# Altium project WiFi_UPS.PrjPcb
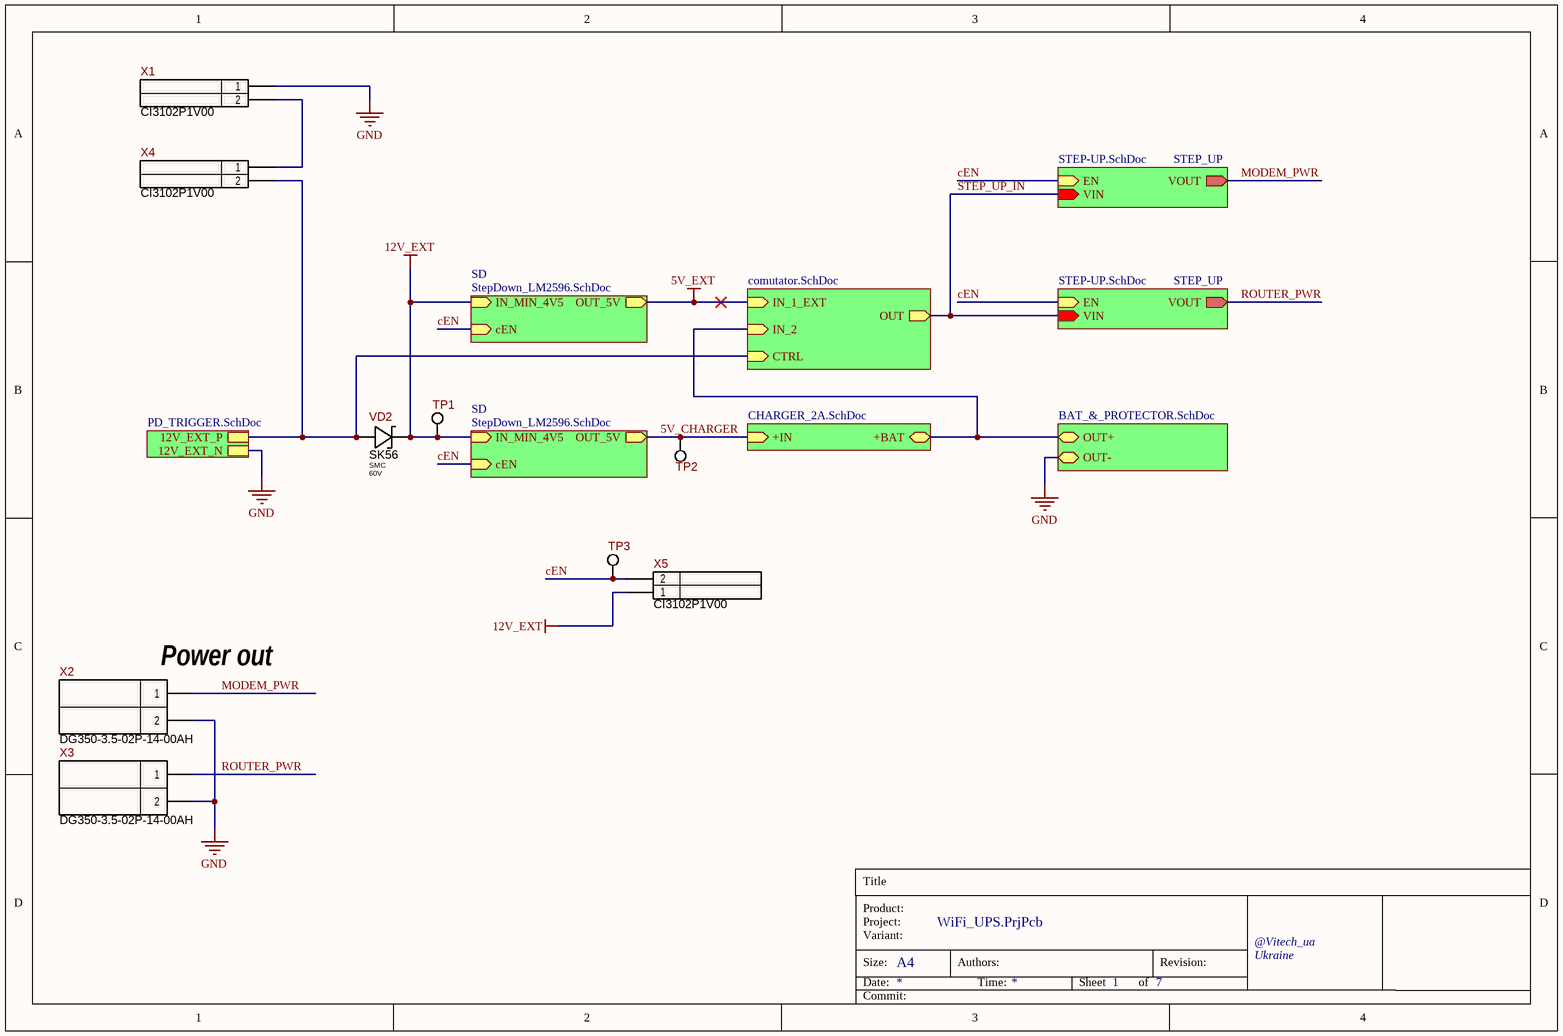
[diagram p0: MAIN.SchDoc]
__Project_Template_Version: 1.0.3; _Amount_Boards_Per_Stand: 1; _PCB_Order_Accuracy: 0.2mm / 8mil; _PCB_Order_BoardOutlineLayer: Mechanical1 (GM1); _PCB_Order_CastellatedHolesEdges: No; _PCB_Order_Cooper: 1oz / 35um; _PCB_Order_ElectricTest: Necessarily for 100% samples; _PCB_Order_Finish: HASL; _PCB_Order_LayersCnt: 2; _PCB_Order_Mask: on both sides; _PCB_Order_MaskColor: Green / Yellow; _PCB_Order_Material: FR-4; _PCB_Order_MinHole: 0.3 mm; _PCB_Order_ProductionTime: 2 weeks; _PCB_Order_Silk: No; _PCB_Order_SilkColor: No; _PCB_Order_Size: 134 x 85 mm; _PCB_Order_Thickness: 1.6 mm; Authors: Starovit; Product_Name: WiFi_UPS; Project_ID: 001; Project_Version: 4
7 sheets, 121 parts. Net scope: hierarchical (ports join the sheet entries above them; power ports are global).
Board file: pcb.PcbDoc
Sheets:
  MAIN.SchDoc
    STEP_UP = STEP-UP.SchDoc
    charger = CHARGER_2A.SchDoc
    COMUTATOR = comutator.SchDoc
    pROTECTOR = BAT_&_PROTECTOR.SchDoc
    Designator = PD_TRIGGER.SchDoc
    SD = StepDown_LM2596.SchDoc
    STEP_UP = STEP-UP.SchDoc
    SD = StepDown_LM2596.SchDoc

## Sheet MAIN.SchDoc: =DocumentName
size A4; Author: Starovit; CompanyName: "AS Manufacturing" LLC; Organization: "AS Manufacturing" LLC; Address1: 5 Sklyarenka St.; Address2: Kyiv 04073; Address3: Ukraine; Address4: https://ajax.systems/en/; DocumentNumber: 1; Revision: v4; SheetNumber: 1; SheetTotal: 7; Product name: WiFi_UPS; Internal reference: 001; Head: WiFi_UPS.001.v4; PCB_Designator: WiFi_UPS.001.v4; Template_version: 1.0.1

### Parts
TP1  PAD-0.96mm  [PAD-0.96mm]  (value not drawn)  (no BOM)
TP2  PAD-0.96mm  [PAD-0.96mm]  (value not drawn)  (no BOM)
TP3  PAD-0.96mm  [PAD-0.96mm]  (value not drawn)  (no BOM)
VD2  Voltage: 60V  [SMC]  (hidden comment: SK56)
X1  WH-02S  [WF-2S]  (value not drawn)
X2  DG350-3.5-02P  [DG350-3.5-02P-14-00AH]  (value not drawn)  (no BOM)
X3  DG350-3.5-02P  [DG350-3.5-02P-14-00AH]  (value not drawn)  (no BOM)
X4  WH-02S  [WF-2S]  (value not drawn)
X5  WH-02S  [WF-2S]  (value not drawn)

### Sub-sheets
charger = CHARGER_2A.SchDoc: +BAT (bidir), +IN (in)
COMUTATOR = comutator.SchDoc: IN_1_EXT (in), IN_2 (in), OUT (out), CTRL (in)
Designator = PD_TRIGGER.SchDoc: 12V_EXT_P, 12V_EXT_N
pROTECTOR = BAT_&_PROTECTOR.SchDoc: OUT+ (bidir), OUT- (bidir)
SD = StepDown_LM2596.SchDoc: IN_MIN_4V5 (in), OUT_5V (out), cEN (in)
SD = StepDown_LM2596.SchDoc: IN_MIN_4V5 (in), OUT_5V (out), cEN (in)
STEP_UP = STEP-UP.SchDoc: VIN (in), VOUT (out), EN (in)
STEP_UP = STEP-UP.SchDoc: VIN (in), VOUT (out), EN (in)

### Nets
5V_EXT: sheet STEP_UP/VIN, sheet COMUTATOR/IN_1_EXT, sheet COMUTATOR/OUT, sheet SD/OUT_5V, sheet STEP_UP/VIN  [also labelled STEP_UP_IN]
12V_EXT: TP1.1 VD2.CA X5.1 ; sheet SD/IN_MIN_4V5, sheet SD/IN_MIN_4V5
GND: X1.1 X2.2 X3.2 ; sheet pROTECTOR/OUT-, sheet Designator/12V_EXT_N
5V_CHARGER: TP2.1 ; sheet charger/+IN, sheet SD/OUT_5V
cEN: TP3.1 X5.2 ; sheet STEP_UP/EN, sheet SD/cEN, sheet STEP_UP/EN, sheet SD/cEN
MODEM_PWR: X2.1 ; sheet STEP_UP/VOUT
ROUTER_PWR: X3.1 ; sheet STEP_UP/VOUT
NetC14_1: sheet charger/+BAT, sheet COMUTATOR/IN_2, sheet pROTECTOR/OUT+
NetFP11_1: VD2.AN X4.2 ; sheet COMUTATOR/CTRL, sheet Designator/12V_EXT_P
NetX1_2: X1.2 X4.1

### Notes on the sheet
- (near X2) Power out
- Title
- Product:
- Project:
- Size:
- Date:
- Variant:
- A4
- Authors:
- Time:
- Sheet
- of
- Revision:
- @Vitech_ua
- Commit:

### Library data of the parts
TP1-TP3 = PAD-0.96mm: 0.96mm Pad for Plug-In or Receptacle; Ajax_1C_PN: NONE; Ajax_1С_Status: RND Only; Component Status: Released; Part Number: PAD-0.96mm; Component Type: PTH; Manufacturer: NONE; Part Type: Pad; Temperature Range: NONE; ComponentLink1URL: NONE; Replacement: NONE; Price: NONE; ComponentLink1Description: Datasheet
VD2 = SS34: Diode Schottky 60V 5A, SMC; Manufacturer: KLS; Component Status: Released; Standard Lead Time: 14 Weeks; Current: 3A; Vf: 500mV @ 3A; Replacement: NONE; Part Number: SK56; Package: SMC; Part Type: Schottky; Component Type: SMD; Marking: SK56; Temperature Range: -55°C ~ 150°C; Supplier 1: Digi-Key; Supplier Part Number 1: SS34FSCT-ND; Price: 0.03; ComponentLink1Description: Datasheet
X1 X4 X5 = CI3102P1V00: WH Series 2.54mm Wire to Board Straight DIP Type Headers, 2 Pin; Manufacturer: CviLux; Replacement: NONE; Part Number: CI3102P1V00; Part Type: Wire-to-Board / Header; Component Type: PTH; Temperature Range: -25℃ ~ 85℃; Price: 0.02434867; ComponentLink1Description: Datasheet
X2 X3 = DG350-3.5-02P-14-00AH: Screw Terminal, 3.5mm Pitch, 2 pin, Green; Manufacturer: Degson; Ajax_1C_ID: 21524; Ajax_1C_PN: DG350-3.5-02P-14-00AH, клеммник; Ajax_1С_Status: RND Only; Component Status: Released; Replacement: NONE; GUID_1C: 367ff815-d639-11ea-ab63-0050569f2651; Part Number: DG350-3.5-02P-14-00AH; Part Type: Terminal; Component Type: PTH; Temperature Range: -40°C ~ 105°C; ComponentLink1URL: \\altiumdb.ajax.local\files\Datasheet\Connectors\DG350-3.5,3.96.pdf; Price: 0,17091154; ComponentLink1Description: Datasheet

## Sheet STEP-UP.SchDoc: =DocumentName
size A4; Author: Starovit; CompanyName: "AS Manufacturing" LLC; Organization: "AS Manufacturing" LLC; Address1: 5 Sklyarenka St.; Address2: Kyiv 04073; Address3: Ukraine; Address4: https://ajax.systems/en/; DocumentNumber: 2; Revision: v4; SheetNumber: 2; SheetTotal: 7; Product name: WiFi_UPS; Internal reference: 001; Head: WiFi_UPS.001.v4; PCB_Designator: WiFi_UPS.001.v4; Template_version: 1.0.1
Used 2 times, as channels STEP_UP, STEP_UP. Parts and nets are listed once, with the designators drawn on the sheet.
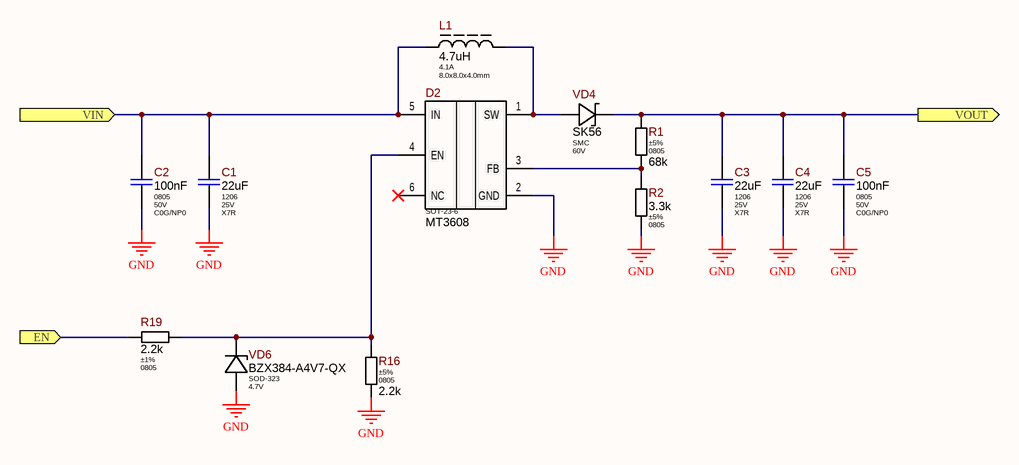
[diagram p1: STEP-UP.SchDoc]

### Parts
C1  Package: 1206  Voltage: 25V  Dielectric Type: X7R  [C_CERAMIC_1206_MED]  (hidden comment: 22uF)
C2  Package: 0805  Voltage: 50V  Dielectric Type: C0G/NP0  [C_CERAMIC_0805_HI]  (hidden comment: 100nF)
C3  Package: 1206  Voltage: 25V  Dielectric Type: X7R  [C_CERAMIC_1206_MED]  (hidden comment: 22uF)
C4  Package: 1206  Voltage: 25V  Dielectric Type: X7R  [C_CERAMIC_1206_MED]  (hidden comment: 22uF)
C5  Package: 0805  Voltage: 50V  Dielectric Type: C0G/NP0  [C_CERAMIC_0805_HI]  (hidden comment: 100nF)
D2  Package: SOT-23-6  [MT3608_MED]  (hidden comment: MT3608)
L1  Current: 4.1A  Package: 8.0x8.0x4.0mm  [SWPA8040S-Series]  (hidden comment: 4.7uH)
R1  Tolerance: ±5%  Package: 0805  [R_ANY_CHIP_0805_MED]  (hidden comment: 68k)
R2  Tolerance: ±5%  Package: 0805  [R_ANY_CHIP_0805_MED]  (hidden comment: 3.3k)
R16  Tolerance: ±5%  Package: 0805  [R_ANY_CHIP_0805_MED]  (hidden comment: 2.2k)
R19  Tolerance: ±1%  Package: 0805  [R_ANY_CHIP_0805_MED]  (hidden comment: 2.2k)
VD4  Voltage: 60V  [SMC]  (hidden comment: SK56)
VD6  Package: SOD-323  Voltage: 4.7V  [SOD-323_MED]  (hidden comment: BZX384-A4V7-QX)

### Ports
EN (in), VIN (in), VOUT (out)

### Nets
GND: C1.2 C2.2 C3.2 C4.2 C5.2 D2.2(GND) R2.2 R16.2 VD6.AN
EN: R19.1 ; port EN
VIN: C1.1 C2.1 D2.5(IN) L1.1 ; port VIN
VOUT: C3.1 C4.1 C5.1 R1.1 VD4.CA ; port VOUT
NetD2_1: D2.1(SW) L1.2 VD4.AN
NetD2_3: D2.3(FB) R1.2 R2.1
NetD2_4: D2.4(EN) R16.1 R19.2 VD6.CA

Not connected (* = marked no-connect by the designer): D2 6(NC)*

### Channels
STEP_UP: designators end in B; ports EN=cEN VIN=5V_EXT VOUT=MODEM_PWR
STEP_UP: designators end in A; ports EN=cEN VIN=5V_EXT VOUT=ROUTER_PWR

### Notes on the sheet
- Title
- Product:
- Project:
- Size:
- Date:
- Variant:
- A4
- Authors:
- Time:
- Sheet
- of
- Revision:
- @Vitech_ua
- Commit:

### Library data of the parts
C1 C3 C4 = 1206B102K102CG: 22uF 25V; Part Number: CL31A226KAHNNNE; Manufacturer: SAMSUNG; Standard Lead Time: 31 Weeks; Component Status: Released; Tolerance: ±10%; Replacement: NONE; Value: 22uF; Part Type: Ceramic / X7R / 1206; Component Type: SMD; Temperature Range: -55°C ~ 125°C; ComponentLink1URL: https://eu.mouser.com/datasheet/2/210/Middle_and_High_Voltage_DS-1535659.pdf; Supplier 1: Mouser; Supplier Part Number 1: 791-1206B102K102CT; Price: 0; ComponentLink1Description: Datasheet
C2 C5 = CERAMIC_0805: Part Number: **; Manufacturer: Hitano; Component Status: Released; Tolerance: ±5%; Replacement: NONE; GUID_1C: 32087c8a-96b8-11ea-ab61-0050569f2651; Part Type: Ceramic / C0G(NP0) / 0402; Component Type: SMD; Temperature Range: -55°C ~ 125°C; ComponentLink1URL: \\altiumdb.ajax.local\files\Datasheet\Capacitor\Hitano-MLCC.pdf; Price: 0; ComponentLink1Description: Datasheet; Value: 100nF
D2 = MT3608: 2V-24V Input High Efficiency 1.2MHz 2A Step Up Converter; Manufacturer: Aerosemi; Ajax_1C_ID: 8101; Ajax_1C_PN: MT3608 Aerosemi 2A Step Up Converter IC SOT-23-6; Ajax_1С_Status: Mass Production; Standard Lead Time: NONE; Component Status: Released; GUID_1C: 8b925ac5-fc04-11e5-817b-d8cb8a9acc66; Part Number: MT3608; Lifecycle: Not Recommended; Part Type: Power / DC-DC / Boost; Component Type: SMD; Temperature Range: -40°C ~ 85°C; ComponentLink1URL: https://www.olimex.com/Products/Breadboarding/BB-PWR-3608/resources/MT3608.pdf; Replacement: NONE; Price: 0,12; ComponentLink1Description: Datasheet
L1 = SWPA8040S4R7NT: 4.7uH Magnetic-Resin Shielded Wirewound Inductor 4.1 A 25mOhm Max; Manufacturer: Shenzhen Sunlord Electronics; Ajax_1C_ID: 85672; Ajax_1C_PN: 4.7uH 30% 4.1A 25mOhm Max SWPA8040S4R7NT SMD Power Inductor; Ajax_1С_Status: RND Only; Saturation Current: 5.9A; Tolerance: ±30%; Component Status: Released; Standard Lead Time: 16 Weeks; Replacement: NONE; GUID_1C: 9a5367f7-7c8d-11ee-a921-00505699469b; Value: 4.7uH; Part Number: SWPA8040S4R7NT; Part Type: Power / Ferrite Core; Component Type: SMD; Temperature Range: -40°C ~ 125°C; ComponentLink1URL: \\altiumdb.ajax.local\files\Datasheet\Inductors\SWPA_Series_of_SMD_Power_Inductor.pdf; Supplier 1: Digi-Key; Supplier Part Number 1: 3442-SWPA8040S4R7NTTR-ND; Price: 0,83075; ComponentLink1Description: Datasheet
R1 R16 = RC0805JR-072K2L: 2.2 kOhms ±5% 1/8W 0805 Thick Film Resistor; Manufacturer: Yageo; Ajax_1C_ID: 26119; Ajax_1C_PN: 2.2k 5% 0805 Resistors SMD RoHS; Ajax_1С_Status: RND Only; Power Rating: 0.125W; Voltage: 150V; Component Status: Released; Temperature Stability: ±100ppm/°C; Replacement: NONE; GUID_1C: 80325ec8-617a-11eb-ab6f-0050569f2651; Part Number: RC0805JR-072K2L; Component Type: SMD; Part Type: Thick Film; Temperature Range: -55°C ~ 155°C; ComponentLink1URL: https://eu.mouser.com/datasheet/2/447/PYu_RC_Group_51_RoHS_L_11-1984063.pdf; Supplier 1: Digi-Key; Supplier Part Number 1: 311-2.2KARTR-ND; ComponentLink1Description: Datasheet
  R1: Value: 68k; Price: 0,005
  R16: Value: 2.2k; Price: 0.0011
R2 = RC0805JR-073K3L: 3.3 kOhms ±5%, 1/8W 0805 Thick Film Resistor; Manufacturer: Yageo; Ajax_1C_ID: 9030; Ajax_1C_PN: 3.3k 5% 0805 Resistors SMD RoHS; Ajax_1С_Status: RND Only; Power Rating: 0.125W; Voltage: 150V; Component Status: Released; Temperature Stability: ±100ppm/°C; Replacement: NONE; GUID_1C: cb9785ec-9b47-11e6-8242-d8cb8a9acc66; Value: 3.3k; Part Number: RC0805JR-073K3L; Component Type: SMD; Part Type: Thick Film; Temperature Range: -55°C ~ 155°C; ComponentLink1URL: https://eu.mouser.com/datasheet/2/447/PYu_RC_Group_51_RoHS_L_10-1664068.pdf; Price: 0,001081; ComponentLink1Description: Datasheet
R19 = RC0805FR-072K2L: 2.2 kOhms ±1% 1/8W 0805 Thick Film Resistor; Manufacturer: Yageo; Ajax_1C_ID: 30906; Ajax_1C_PN: 2.2k 1% 0805 Resistors SMD RoHS; Ajax_1С_Status: RND Only; Power Rating: 0.125W; Voltage: 150V; Component Status: Released; Temperature Stability: ±100ppm/°C; Replacement: NONE; GUID_1C: 690422a9-c9eb-11eb-ab74-0050569f2651; Value: 2.2k; Part Number: RC0805FR-072K2L; Component Type: SMD; Part Type: Thick Film; Temperature Range: -55°C ~ 155°C; ComponentLink1URL: https://eu.mouser.com/datasheet/2/447/YAGEO_PYu_RC_Group_51_RoHS_L_12-3313492.pdf; Supplier 1: Mouser; Supplier Part Number 1: 603-RC0805FR-072K2L; Price: 0.0014; ComponentLink1Description: Datasheet
VD4 = SS34: as VD2 on sheet MAIN; Part Number: SK56; Package: SMC; Part Type: Schottky; Component Type: SMD; Marking: SK56; Temperature Range: -55°C ~ 150°C; Supplier 1: Digi-Key; Supplier Part Number 1: SS34FSCT-ND; Price: 0.03; ComponentLink1Description: Datasheet
VD6 = BZX384-A4V7-QX: Zener Diode 4.7V, 300mW, ±1%, Leakage 3uA @ 2V, SOD-323; Manufacturer: Nexperia USA; Ajax_1C_PN: NONE; Ajax_1С_Status: RND Only; Marking: 22; Component Status: Released; Standard Lead Time: 4 Weeks; Part Number: BZX384-A4V7-QX; Part Type: Zener; Component Type: SMD; Temperature Range: -65°C ~ 150°C; ComponentLink1URL: https://eu.mouser.com/datasheet/2/916/BZX384_Q_SER-2721638.pdf; Supplier 1: Mouser; Supplier Part Number 1: 771-BZX384-A4V7-QX; Replacement: NONE; Price: NONE; ComponentLink1Description: Datasheet

## Sheet CHARGER_2A.SchDoc: =DocumentName
size A4; Author: Starovit; CompanyName: "AS Manufacturing" LLC; Organization: "AS Manufacturing" LLC; Address1: 5 Sklyarenka St.; Address2: Kyiv 04073; Address3: Ukraine; Address4: https://ajax.systems/en/; DocumentNumber: 5; Revision: v4; SheetNumber: 5; SheetTotal: 7; Product name: WiFi_UPS; Internal reference: 001; Head: WiFi_UPS.001.v4; PCB_Designator: WiFi_UPS.001.v4; Template_version: 1.0.1
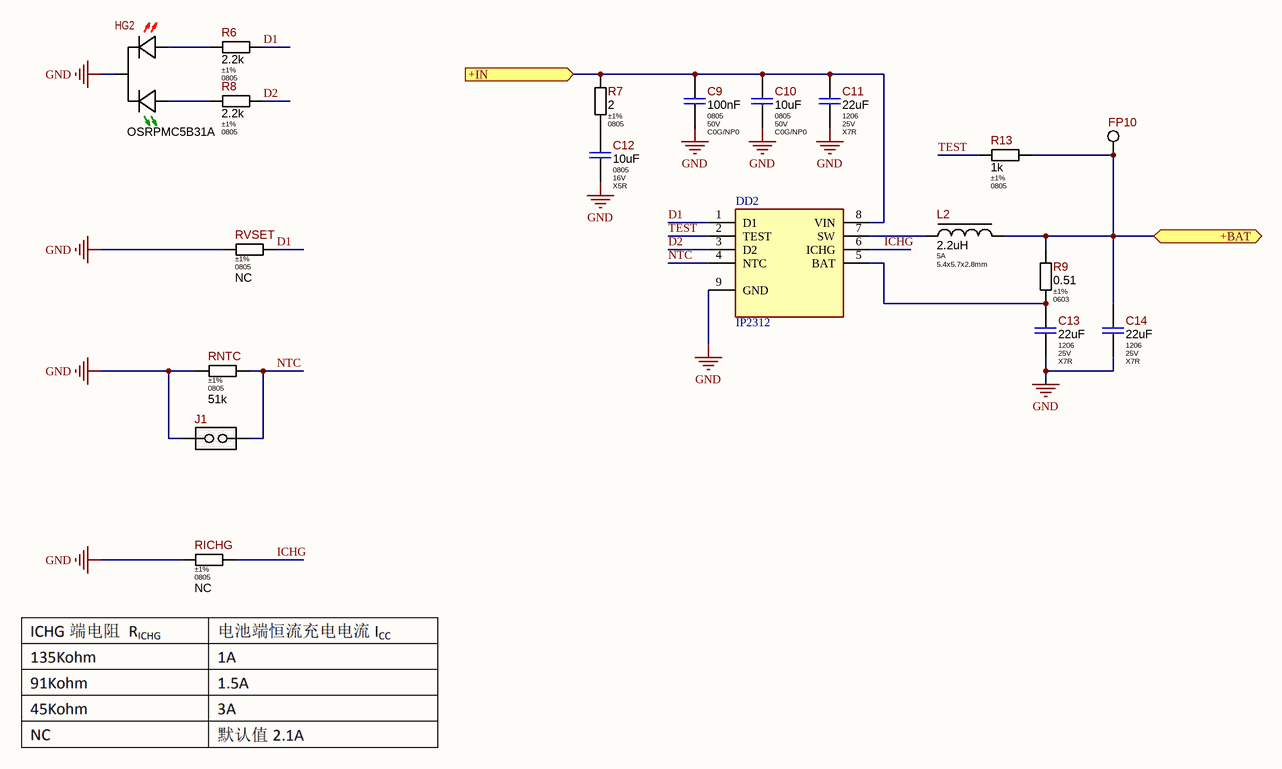
[diagram p2: CHARGER_2A.SchDoc]

### Parts
C9  Package: 0805  Voltage: 50V  Dielectric Type: C0G/NP0  [C_CERAMIC_0805_HI]  (hidden comment: 100nF)
C10  Package: 0805  Voltage: 50V  Dielectric Type: C0G/NP0  [C_CERAMIC_0805_HI]  (hidden comment: 10uF)
C11  Package: 1206  Voltage: 25V  Dielectric Type: X7R  [C_CERAMIC_1206_MED]  (hidden comment: 22uF)
C12  Package: 0805  Voltage: 16V  Dielectric Type: X5R  [CAP-0805(2012)X125T15]  (hidden comment: 10uF)
C13  Package: 1206  Voltage: 25V  Dielectric Type: X7R  [C_CERAMIC_1206_MED]  (hidden comment: 22uF)
C14  Package: 1206  Voltage: 25V  Dielectric Type: X7R  [C_CERAMIC_1206_MED]  (hidden comment: 22uF)
DD2  IP2312  [IP2313]
FP10  PAD-1.45mm  [PAD-1.45mm]  (value not drawn)  (no BOM)
HG2  OSRPMC5B31A  [OSRPMC5B31A]
J1  PLS-2 (Part of PLS-40)  [PLS-2]  (value not drawn)
L2  Current: 5A  Package: 5.4x5.7x2.8mm  [BMRA00050530-Series]  (hidden comment: 2.2uH)
R6  Tolerance: ±1%  Package: 0805  [R_ANY_CHIP_0805_MED]  (hidden comment: 2.2k)
R7  Tolerance: ±1%  Package: 0805  [R_ANY_CHIP_0805_MED]  (hidden comment: 2)
R8  Tolerance: ±1%  Package: 0805  [R_ANY_CHIP_0805_MED]  (hidden comment: 2.2k)
R9  Tolerance: ±1%  Package: 0603  [R_ANY_CHIP_0603_MED]  (hidden comment: 0.51)
R13  Tolerance: ±1%  Package: 0805  [R_ANY_CHIP_0805_MED]  (hidden comment: 1k)
RICHG  Tolerance: ±1%  Package: 0805  [R_ANY_CHIP_0805_MED]  (hidden comment: NC)
RNTC  Tolerance: ±1%  Package: 0805  [R_ANY_CHIP_0805_MED]  (hidden comment: 51k)
RVSET  Tolerance: ±1%  Package: 0805  [R_ANY_CHIP_0805_MED]  (hidden comment: NC)

### Ports
+BAT (bidir), +IN (in)

### Nets
GND: C9.2 C10.2 C11.2 C12.2 C13.2 C14.2 DD2.9(GND) HG2.CC(Cathode) J1.1 RICHG.1 RNTC.1 RVSET.1
5V_CHARGER: C9.1 C10.1 C11.1 DD2.8(VIN) R7.1 ; port +IN
D1: DD2.1(D1) R6.2 RVSET.2
D2: DD2.3(D2) R8.2
ICHG: DD2.6(ICHG) RICHG.2
NTC: DD2.4(NTC) J1.2 RNTC.2
TEST: DD2.2(TEST) R13.1
NetC12_1: C12.1 R7.2
NetC13_1: C13.1 DD2.5(BAT) R9.2
NetC14_1: C14.1 FP10.1 L2.2 R9.1 R13.2 ; port +BAT
NetDD2_7: DD2.7(SW) L2.1
NetHG2_A1: HG2.A1 R6.1
NetHG2_A2: HG2.A2 R8.1

### Notes on the sheet
- Title
- Product:
- Project:
- Size:
- Date:
- Variant:
- A4
- Authors:
- Time:
- Sheet
- of
- Revision:
- @Vitech_ua
- Commit:

### Library data of the parts
C9 C10 = CERAMIC_0805: as C2 on sheet STEP-UP; Part Type: Ceramic / C0G(NP0) / 0402; Component Type: SMD; Temperature Range: -55°C ~ 125°C; ComponentLink1URL: \\altiumdb.ajax.local\files\Datasheet\Capacitor\Hitano-MLCC.pdf; Price: 0; ComponentLink1Description: Datasheet
  C9: Value: 100nF
  C10: Value: 10uF
C11 C13 C14 = 1206B102K102CG: as C1 on sheet STEP-UP; Value: 22uF; Part Type: Ceramic / X7R / 1206; Component Type: SMD; Temperature Range: -55°C ~ 125°C; ComponentLink1URL: https://eu.mouser.com/datasheet/2/210/Middle_and_High_Voltage_DS-1535659.pdf; Supplier 1: Mouser; Supplier Part Number 1: 791-1206B102K102CT; Price: 0; ComponentLink1Description: Datasheet
C12 = CL21A106KOQNNNE: 10uF 16V Х5R ±10% 0805 Ceramic Capacitor RoHS; Manufacturer: Samsung Electro-Mechanics; Ajax_1C_ID: 2350; Ajax_1C_PN: 10uF 16V Х5R 10% 0805 CL21A106KOQNNNE Ceramic Capacitor SMD RoHS; Ajax_1С_Status: Mass Production; Standard Lead Time: 22 Weeks; Component Status: Released; Replacement: NONE; GUID_1C: 272845d6-647b-11e2-9b5b-6c626deda1bb; Value: 10uF; Part Number: CL21A106KOQNNNE; Part Type: Ceramic / X5R / 0805; Component Type: SMD; Temperature Range: -55°C ~ 85°C; Tolerance: ±10%; ComponentLink1URL: https://media.digikey.com/pdf/Data%20Sheets/Samsung%20PDFs/CL_Series_MLCC_ds.pdf; Supplier 1: Digi-Key; Supplier Part Number 1: 1276-1096-2-ND; Price: 0,0072; ComponentLink1Description: Datasheet
FP10 = PAD-1.45mm: 1.45mm Pad for Plug-In or Receptacle; Ajax_1C_PN: NONE; Ajax_1С_Status: RND Only; Component Status: Released; Part Number: PAD-1.45mm; Component Type: PTH; Manufacturer: NONE; Part Type: Pad; Temperature Range: NONE; ComponentLink1URL: NONE; Replacement: NONE; Price: NONE; ComponentLink1Description: Datasheet
HG2 = OSRPMC5B31A: 5mm Phoenix Red & Pure Green LED, 625nm and 525nm, 30°; Manufacturer: OptoSupply; Ajax_1C_ID: 42089; Ajax_1C_PN: OSRPMC5B31A F5  RED/GREEN 3.3V  Common Cathode; Ajax_1С_Status: RND Only; Component Status: On Review; Wavelength: 625nm, 525nm; Replacement: NONE; GUID_1C: 10faf48a-c158-11ec-a35b-005056994834; Part Number: OSRPMC5B31A; Part Type: LED / 5mm; Component Type: PTH; Package: 5mm; Color: Red, Green; Temperature Range: -30°C ~ 85°C; ComponentLink1URL: \\altiumdb.ajax.local\files\Datasheet\Opto\OSRPMC5B31A.pdf; Price: 0,125; ComponentLink1Description: Datasheet
J1 = DS1021-02SF11: 2 Pin 2.54mm Male Header, Vertical, 3mm and 6.1mm, PLS-2; Manufacturer: Connfly; Ajax_1C_ID: 1215; Ajax_1C_PN: PLS40, планки со штырьками; Ajax_1С_Status: Mass Production; Component Status: Released; Replacement: NONE; GUID_1C: 10be163c-dd40-11e0-af93-6c626deda1bb; Part Number: DS1021-02SF11; Part Type: Header / Male Pin / Single Row; Component Type: PTH; Temperature Range: -40°C ~ 105°C; ComponentLink1URL: \\altiumdb.ajax.local\files\Datasheet\Connectors\DS1021.pdf; Price: 0,001875; ComponentLink1Description: Datasheet
L2 = BMRA000505302R2MA1: 2.2uH 5A 35mOhm max Closed Magnetic, Molding Processing, Ultra High Current Power Inductor; Manufacturer: Chilisin; Ajax_1C_ID: 84493; Ajax_1C_PN: 2.2uH 20% 5A 5.7x5.4mm BMRA000505302R2MA1 Chilisin Electronics; Ajax_1С_Status: RND Only; Saturation Current: 8A; Tolerance: ±20%; Component Status: Released; Replacement: NONE; GUID_1C: 5ef22b21-6e83-11ee-a91e-00505699469b; Value: 2.2uH; Part Number: BMRA000505302R2MA1; Part Type: Power / Wirewound; Component Type: SMD; Temperature Range: -55°C ~ 125°C; ComponentLink1URL: https://eu.mouser.com/datasheet/2/447/BMRx_Series-2943964.pdf; Supplier 1: Digi-Key; Supplier Part Number 1: 553-BMRA000505302R2MA1TR-ND; Price: 0,7; ComponentLink1Description: Datasheet
R6 R8 = RC0805FR-072K2L: as R19 on sheet STEP-UP; Value: 2.2k; Part Number: RC0805FR-072K2L; Component Type: SMD; Part Type: Thick Film; Temperature Range: -55°C ~ 155°C; ComponentLink1URL: https://eu.mouser.com/datasheet/2/447/YAGEO_PYu_RC_Group_51_RoHS_L_12-3313492.pdf; Supplier 1: Mouser; Supplier Part Number 1: 603-RC0805FR-072K2L; Price: 0.0014; ComponentLink1Description: Datasheet
R7 = RC0805FR-072RL: 2 Ohm ±1%, 1/8W 0805 Thick Film Resistor; Manufacturer: Yageo; Ajax_1C_ID: 9244; Ajax_1C_PN: 2R 1% 0805  Resistors SMD RoHS; Ajax_1С_Status: RND Only; Power Rating: 0.125W; Voltage: 150V; Component Status: Released; Temperature Stability: ±200ppm/°C; Replacement: NONE; GUID_1C: 2cef56fd-bde9-11e6-826e-d8cb8a9acc66; Value: 2; Part Number: RC0805FR-072RL; Component Type: SMD; Part Type: Thick Film; Temperature Range: -55°C ~ 155°C; ComponentLink1URL: https://eu.mouser.com/datasheet/2/447/PYu_RC_Group_51_RoHS_L_10-1664068.pdf; Supplier 1: Mouser; Supplier Part Number 1: 603-RC0805FR-072RL; Price: 0,09; ComponentLink1Description: Datasheet
R9 = RL0603FR-070R51L: 510 mOhms ±1%, 1/10W 0603 Thick Film Resistor; Manufacturer: Yageo; Ajax_1C_ID: 15962; Ajax_1C_PN: 0.51R 1% 0603 Resistors SMD RoHS; Ajax_1С_Status: RND Only; Power Rating: 0.1W; Voltage: NONE; Component Status: Released; Temperature Stability: ±300ppm/°C; GUID_1C: c10a41ba-7620-11e9-ab53-0050569f2651; Value: 0.51; Part Number: RL0603FR-070R51L; Component Type: SMD; Part Type: Thick Film; Temperature Range: -55°C ~ 155°C; ComponentLink1URL: https://www.yageo.com/upload/media/product/productsearch/datasheet/rchip/PYu-RL_Group_521_RoHS_L_2.pdf; Supplier 1: Digi-Key; Supplier Part Number 1: 311-.51QTR-ND; Replacement: NONE; Price: 0,04488; ComponentLink1Description: Datasheet
R13 = RC0805FR-071KL: 1 kOhms ±1%, 1/8W 0805 Thick Film Resistor; Manufacturer: Yageo; Ajax_1C_ID: 8520; Ajax_1C_PN: 1k 1% 0805 Resistors SMD RoHS; Ajax_1С_Status: Mass Production; Power Rating: 0.125W; Voltage: 150V; Component Status: Released; Temperature Stability: ±100ppm/°C; Replacement: NONE; GUID_1C: 0c53a8ec-2890-11e6-81ae-d8cb8a9acc66; Value: 1k; Part Number: RC0805FR-071KL; Component Type: SMD; Part Type: Thick Film; Temperature Range: -55°C ~ 155°C; ComponentLink1URL: https://eu.mouser.com/datasheet/2/447/PYu_RC_Group_51_RoHS_L_10-1664068.pdf; Supplier 1: Digi-Key; Supplier Part Number 1: 311-1.00KCRTR-ND; Price: 0,0014; ComponentLink1Description: Datasheet
RICHG RVSET = RC0805FR-07120RL: Manufacturer: Yageo; Ajax_1C_ID: 14156; Ajax_1C_PN: 120R 1% 0805 Resistors SMD RoHS; Ajax_1С_Status: Mass Production; Power Rating: 0.125W; Voltage: 150V; Component Status: Released; Temperature Stability: ±100ppm/°C; Replacement: NONE; GUID_1C: b31bb40e-dc54-11e8-ab4a-0050569f2651; Value: NC; Part Number: RC0805FR-07120RL; Component Type: SMD; Part Type: Thick Film; Temperature Range: -55°C ~ 155°C; ComponentLink1URL: https://eu.mouser.com/datasheet/2/447/PYu_RC_Group_51_RoHS_L_10-1664068.pdf; Price: 0,0014; ComponentLink1Description: Datasheet
RNTC = RC0805FR-07120RL: Part Number: 0805S8F5102T5E; Manufacturer: Yageo; Ajax_1C_ID: 14156; Ajax_1С_Status: Mass Production; Power Rating: 0.125W; Voltage: 150V; Component Status: Released; Temperature Stability: ±100ppm/°C; Replacement: NONE; GUID_1C: b31bb40e-dc54-11e8-ab4a-0050569f2651; Value: 51k; Ajax_1C_PN: 0805S8F5102T5E; Component Type: SMD; Part Type: Thick Film; Temperature Range: -55°C ~ 155°C; ComponentLink1URL: https://eu.mouser.com/datasheet/2/447/PYu_RC_Group_51_RoHS_L_10-1664068.pdf; Price: 0,0014; ComponentLink1Description: Datasheet

## Sheet comutator.SchDoc: =DocumentName
size A4; Author: Starovit; CompanyName: "AS Manufacturing" LLC; Organization: "AS Manufacturing" LLC; Address1: 5 Sklyarenka St.; Address2: Kyiv 04073; Address3: Ukraine; Address4: https://ajax.systems/en/; DocumentNumber: 4; Revision: v4; SheetNumber: 4; SheetTotal: 7; Product name: WiFi_UPS; Internal reference: 001; Head: WiFi_UPS.001.v4; PCB_Designator: WiFi_UPS.001.v4; Template_version: 1.0.1
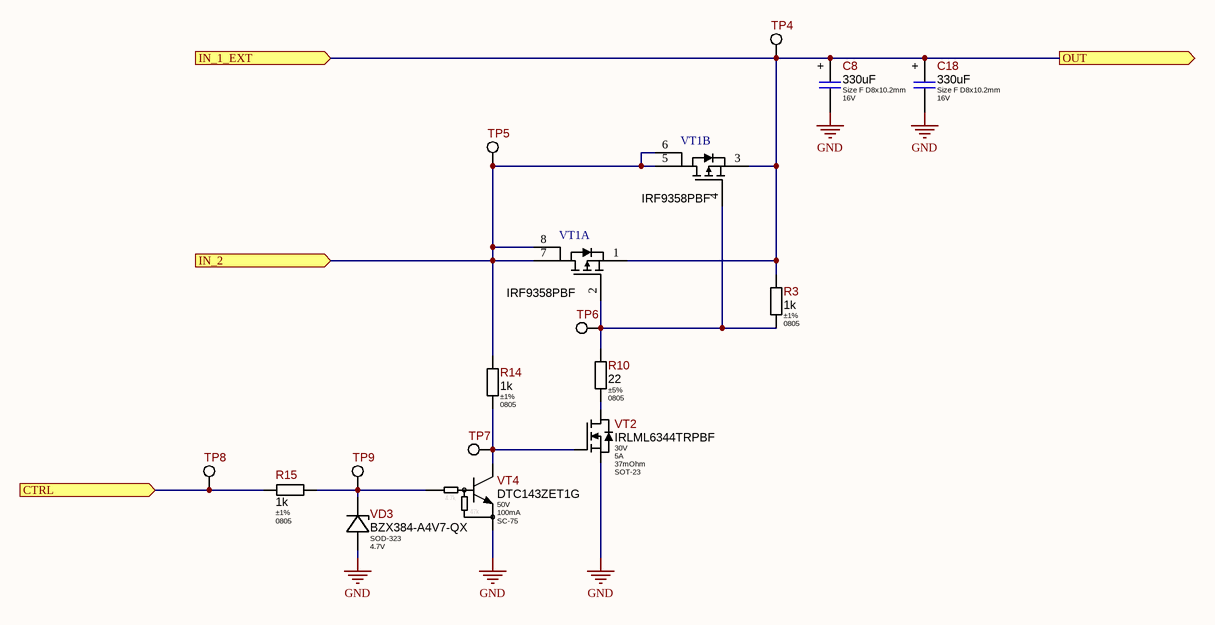
[diagram p3: comutator.SchDoc]

### Parts
C8  value 330uF  Package: Size F D8x10.2mm  Voltage: 16V  [CAP-AE-830x1020H30_MED]  (hidden comment: 330uFx16V)
C18  value 330uF  Package: Size F D8x10.2mm  Voltage: 16V  [CAP-AE-830x1020H30_MED]  (hidden comment: 330uFx16V)
R3  Tolerance: ±1%  Package: 0805  [R_ANY_CHIP_0805_MED]  (hidden comment: 1k)
R10  Tolerance: ±5%  Package: 0805  [R_ANY_CHIP_0805_MED]  (hidden comment: 22)
R14  Tolerance: ±1%  Package: 0805  [R_ANY_CHIP_0805_MED]  (hidden comment: 1k)
R15  Tolerance: ±1%  Package: 0805  [R_ANY_CHIP_0805_MED]  (hidden comment: 1k)
TP4  PAD-0.96mm  [PAD-0.96mm]  (value not drawn)  (no BOM)
TP5  PAD-0.96mm  [PAD-0.96mm]  (value not drawn)  (no BOM)
TP6  PAD-0.96mm  [PAD-0.96mm]  (value not drawn)  (no BOM)
TP7  PAD-0.96mm  [PAD-0.96mm]  (value not drawn)  (no BOM)
TP8  PAD-0.96mm  [PAD-0.96mm]  (value not drawn)  (no BOM)
TP9  PAD-0.96mm  [PAD-0.96mm]  (value not drawn)  (no BOM)
VD3  Package: SOD-323  Voltage: 4.7V  [SOD-323_MED]  (hidden comment: BZX384-A4V7-QX)
VT1  IRF9358PBF  [SOIC-8]  (parts A,B of 2)
VT2  Vds: 30V  Id: 5A  Rds: 37mOhm  Package: SOT-23  [SOT-23_MED]  (hidden comment: IRLML6344)
VT4  Vce: 50V  Ic: 100mA  Package: SC-75  [SOT-416]  (hidden comment: DTC143ZET1G)

### Ports
CTRL (in), IN_1_EXT (in), IN_2 (in), OUT (out)

### Nets
5V_EXT: C8.1 C18.1 R3.1 TP4.1 VT1.1(S2) VT1.3(S1) ; port IN_1_EXT, port OUT
GND: C8.2 C18.2 VD3.AN VT2.2(S) VT4.2(E)
NetC14_1: R14.1 TP5.1 VT1.5(D12) VT1.6(D11) VT1.7(D22) VT1.8(D21) ; port IN_2
NetFP11_1: R15.1 TP8.1 ; port CTRL
NetR3_2: R3.2 R10.1 TP6.1 VT1.2(G2) VT1.4(G1)
NetR10_2: R10.2 VT2.3(D)
NetR14_2: R14.2 TP7.1 VT2.1(G) VT4.3(C)
NetR15_2: R15.2 TP9.1 VD3.CA VT4.1(B)

### Notes on the sheet
- Title
- Product:
- Project:
- Size:
- Date:
- Variant:
- A4
- Authors:
- Time:
- Sheet
- of
- Revision:
- @Vitech_ua
- Commit:
- (in symbol DTC143ZET1G) 4.7k; 47k
- (in symbol EEE-1HA330AP) +

### Library data of the parts
C8 C18 = EEE-1HA330AP: 330uF 50V ±20% Size F D8x10.2mm SMD Aluminum Electrolytic Capacitor, 110mA Ripple Current, 2000 Hrs @ 85°C; Part Number: EEEFK1C331P; Manufacturer: Panasonic; Standard Lead Time: 46 Weeks; Component Status: Released; Dielectric Type: NONE; Part Type: Aluminum; Component Type: SMD; Temperature Range: -40°C ~ 85°C; Tolerance: ±20%; ComponentLink1URL: https://eu.mouser.com/datasheet/2/315/ABA0000C1142-947446.pdf; Supplier 1: Mouser; Supplier Part Number 1: EEEFK1C331P; Replacement: NONE; Price: 0.625; ComponentLink1Description: Datasheet
R3 R14 R15 = RC0805FR-072K2L: as R19 on sheet STEP-UP; Value: 1k; Part Number: RC0805FR-072K2L; Component Type: SMD; Part Type: Thick Film; Temperature Range: -55°C ~ 155°C; ComponentLink1URL: https://eu.mouser.com/datasheet/2/447/YAGEO_PYu_RC_Group_51_RoHS_L_12-3313492.pdf; Supplier 1: Mouser; Supplier Part Number 1: 603-RC0805FR-072K2L; Price: 0.0014; ComponentLink1Description: Datasheet
R10 = RC0805JR-0722RL: 22 Ohms ±5%, 1/8W 0805 Thick Film Resistor; Manufacturer: Yageo; Ajax_1C_ID: 8822; Ajax_1C_PN: 22R 5% 0805 Resistors SMD RoHS; Ajax_1С_Status: Mass Production; Power Rating: 0.125W; Voltage: 150V; Component Status: Released; Temperature Stability: ±100ppm/°C; Replacement: NONE; GUID_1C: 3ba40fec-5951-11e6-81ec-d8cb8a9acc66; Value: 22; Part Number: RC0805JR-0722RL; Component Type: SMD; Part Type: Thick Film; Temperature Range: -55°C ~ 155°C; ComponentLink1URL: https://eu.mouser.com/datasheet/2/447/PYu_RC_Group_51_RoHS_L_10-1664068.pdf; Price: 0.0011; ComponentLink1Description: Datasheet
TP4-TP9 = PAD-0.96mm: as TP1 on sheet MAIN; Part Number: PAD-0.96mm; Component Type: PTH; Manufacturer: NONE; Part Type: Pad; Temperature Range: NONE; ComponentLink1URL: NONE; Replacement: NONE; Price: NONE; ComponentLink1Description: Datasheet
VD3 = BZX384-A4V7-QX: as VD6 on sheet STEP-UP; Part Number: BZX384-A4V7-QX; Part Type: Zener; Component Type: SMD; Temperature Range: -65°C ~ 150°C; ComponentLink1URL: https://eu.mouser.com/datasheet/2/916/BZX384_Q_SER-2721638.pdf; Supplier 1: Mouser; Supplier Part Number 1: 771-BZX384-A4V7-QX; Replacement: NONE; Price: NONE; ComponentLink1Description: Datasheet
VT1 = IRF9358PbF: MOSFET 2P-CH 30V 9.2A 8SOIC; Manufacturer: Infineon Technologies; Reverse Recovery Charge: 35nC; Max Forward Diode Voltage: -1.2V; Threshold Vgs Max: -2.4V; Turn Off Delay Time: 146ns; Threshold Vgs Min: -1.3V; Standoff Height: 0.1mm; Input Capacitace At Vds: 1740pF @ -25V; Power Dissipation: 2W; Number Of P Channels: 2; Transconductance: 23S; Rthja Max: 62.5°C/W; Reverse Recovery Time: 55ns; Max Junction Temp: +150°C; Pulse Drain Current: -73A; Turn On Delay Time: 5.7ns; Mouser Description: Dual P-Channel 30 V 16.3 mOhm 19 nC HEXFET® Power Mosfet - SOIC-8; Temperature: -55°C to +150°C; Ipc Land Pattern Name: SOIC127P600X155-8; Number Of Channels: 2; Temperature Range High: +150°C; Temperature Range Low: -55°C; Octopart: https://octopart.com/irf9358pbf-infineon-65873752; Lead Free: Yes; Package: PG-DSO-8; Category: Trans; RoHS: TRUE; Manufacturer Part Number: IRF9358PBF
VT2 = IRLML6344TRPBF: 30V, 5A max N-Channel HEXFET MOSFET, 29mOhm @ Vgs = 4.5V; Manufacturer: Infineon Technologies; Ajax_1C_ID: 9416; Ajax_1C_PN: IRLML6344TRPBF  SOT23. полевой транзистор; Ajax_1С_Status: RND Only; Component Status: Released; Standard Lead Time: 16 Weeks; Replacement: NONE; GUID_1C: 8299d48f-df0c-11e6-829c-d8cb8a9acc66; Part Number: IRLML6344TRPBF; Part Type: N-Channel; Component Type: SMD; Temperature Range: -55°C ~ 150°C; ComponentLink1URL: https://www.infineon.com/dgdl/irlml6344pbf.pdf?fileId=5546d462533600a4015356689c44262c; Supplier 1: Digi-Key; Supplier Part Number 1: IRLML6344TRPBFTR-ND; Price: 0.08596562; ComponentLink1Description: Datasheet
VT4 = DTC143ZET1G: 50V, 100mA Low Vce(sat) NPN Digital Transistor, Pre-Biased 4.7k/47k (with built-in resistors); Manufacturer: Onsemi; Ajax_1C_ID: 9410; Ajax_1C_PN: DTC143ZET1G SC-75-3  биполярный NPN транзистор; Ajax_1С_Status: Mass Production; Component Status: Released; Standard Lead Time: 8 Weeks; Replacement: NONE; GUID_1C: d76ac5d5-de69-11e6-829b-d8cb8a9acc66; Part Number: DTC143ZET1G; Part Type: NPN; Component Type: SMD; Temperature Range: -55°C ~ 150 °C; ComponentLink1URL: http://www.onsemi.com/pub/Collateral/DTC143Z-D.PDF; Supplier 1: Digi-Key; Supplier Part Number 1: DTC143ZET1GOSTR-ND; Price: 0.015; ComponentLink1Description: Datasheet

## Sheet BAT_&_PROTECTOR.SchDoc: =DocumentName
size A4; Author: Starovit; CompanyName: "AS Manufacturing" LLC; Organization: "AS Manufacturing" LLC; Address1: 5 Sklyarenka St.; Address2: Kyiv 04073; Address3: Ukraine; Address4: https://ajax.systems/en/; DocumentNumber: 3; Revision: v4; SheetNumber: 3; SheetTotal: 7; Product name: WiFi_UPS; Internal reference: 001; Head: WiFi_UPS.001.v4; PCB_Designator: WiFi_UPS.001.v4; Template_version: 1.0.1
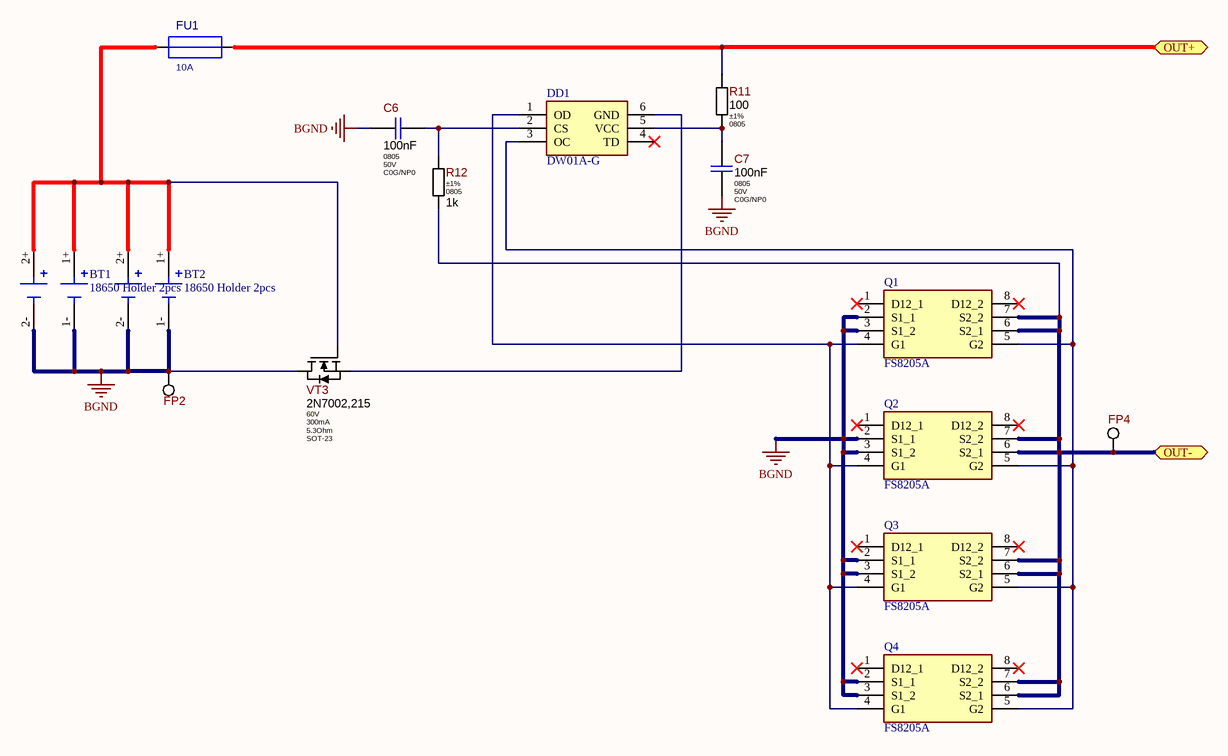
[diagram p4: BAT_&_PROTECTOR.SchDoc]

### Parts
BT1  18650 Holder 2pcs  [BAT_BK-18650-PC4]
BT2  18650 Holder 2pcs  [BAT_BK-18650-PC4]
C6  Package: 0805  Voltage: 50V  Dielectric Type: C0G/NP0  [C_CERAMIC_0805_HI]  (hidden comment: 100nF)
C7  Package: 0805  Voltage: 50V  Dielectric Type: C0G/NP0  [C_CERAMIC_0805_HI]  (hidden comment: 100nF)
DD1  DW01A-G  [DW01A-G]
FP2  PAD-1.45mm  [PAD-1.45mm]  (value not drawn)  (no BOM)
FP4  PAD-1.45mm  [PAD-1.45mm]  (value not drawn)  (no BOM)
FU1  10A  [FU_2410_6.0x2.5x2.5mm_v2]
Q1  FS8205A  [FS8205A]
Q2  FS8205A  [FS8205A]
Q3  FS8205A  [FS8205A]
Q4  FS8205A  [FS8205A]
R11  Tolerance: ±1%  Package: 0805  [R_ANY_CHIP_0805_MED]  (hidden comment: 100)
R12  Tolerance: ±1%  Package: 0805  [R_ANY_CHIP_0805_MED]  (hidden comment: 1k)
VT3  Vds: 60V  Id: 300mA  Rds: 5.3Ohm  Package: SOT-23  [SOT-23_MED]  (hidden comment: 2N7002,215)

### Ports
OUT+ (bidir), OUT- (bidir)

### Nets
BGND: BT1.1- BT1.2- BT2.1- BT2.2- C6.1 C7.2 FP2.1 Q1.2(S1_1) Q1.3(S1_2) Q2.2(S1_1) Q2.3(S1_2) Q3.2(S1_1) Q3.3(S1_2) Q4.2(S1_1) Q4.3(S1_2) VT3.3(D)
GND: FP4.1 Q1.6(S2_1) Q1.7(S2_2) Q2.6(S2_1) Q2.7(S2_2) Q3.6(S2_1) Q3.7(S2_2) Q4.6(S2_1) Q4.7(S2_2) R12.1 ; port OUT-
NetBT1_1+: BT1.1+ BT1.2+ BT2.1+ BT2.2+ FU1.1 VT3.1(G)
NetC6_2: C6.2 DD1.2(CS) R12.2
NetC7_1: C7.1 DD1.5(VCC) R11.1
NetC14_1: FU1.2 R11.2 ; port OUT+
NetDD1_1: DD1.1(OD) Q1.4(G1) Q2.4(G1) Q3.4(G1) Q4.4(G1)
NetDD1_3: DD1.3(OC) Q1.5(G2) Q2.5(G2) Q3.5(G2) Q4.5(G2)
NetDD1_6: DD1.6(GND) VT3.2(S)

Not connected (* = marked no-connect by the designer): DD1 4(TD)*; Q1 1(D12_1)* 8(D12_2)*; Q2 1(D12_1)* 8(D12_2)*; Q3 1(D12_1)* 8(D12_2)*; Q4 1(D12_1)* 8(D12_2)*

### Notes on the sheet
- Title
- Product:
- Project:
- Size:
- Date:
- Variant:
- A4
- Authors:
- Time:
- Sheet
- of
- Revision:
- @Vitech_ua
- Commit:

### Library data of the parts
BT1 BT2 = 18650 Holder 2pcs: Battery Holder (Open) 18650 2 Cell PC Pin; MP: BK-18650-PC4; Price: None; Value: *; Package: None; Availability: Unavailable
C6 C7 = CERAMIC_0805: as C2 on sheet STEP-UP; Part Type: Ceramic / C0G(NP0) / 0402; Component Type: SMD; Temperature Range: -55°C ~ 125°C; ComponentLink1URL: \\altiumdb.ajax.local\files\Datasheet\Capacitor\Hitano-MLCC.pdf; Price: 0; ComponentLink1Description: Datasheet; Value: 100nF
DD1 = DW01A-G: One Cell Lithium-ion/Polymer Battery Protection IC; Component Type: SMD
FP2 FP4 = PAD-1.45mm: as FP10 on sheet CHARGER_2A; Part Number: PAD-1.45mm; Component Type: PTH; Manufacturer: NONE; Part Type: Pad; Temperature Range: NONE; ComponentLink1URL: NONE; Replacement: NONE; Price: NONE; ComponentLink1Description: Datasheet
FU1 = FUSE_SMD_2410_v2: Medium Blow Fuse 65V 15A SMD 2410; Manufacturer: BEL FUSE; Part Number: 0679L9100-01; Power Rating: 10A (Hold); Package: 2410; Value: 10A; Type: Запобіжник; Mount: SMT; Min Operating Temperature: -40°C; Max Operating Temperature: 85°C; Number of Pins: 2; Name: *
Q1-Q4 = FS8205A: Dual N-Channel Enahncement Mode Power MOSFET; Datasheet: https://www.ic-fortune.com/upload/Download/FS8205A-DS-12_EN.pdf; ComponentLink1Description: Data; ComponentLink1URL: https://www.ic-fortune.com/upload/Download/FS8205A-DS-12_EN.pdf
R11 = RC0805FR-07120RL: 100 Ohms ±1%, 1/8W 0805 Thick Film Resistor; Manufacturer: Yageo; Ajax_1C_ID: 14156; Ajax_1C_PN: 120R 1% 0805 Resistors SMD RoHS; Ajax_1С_Status: Mass Production; Power Rating: 0.125W; Voltage: 150V; Component Status: Released; Temperature Stability: ±100ppm/°C; Replacement: NONE; GUID_1C: b31bb40e-dc54-11e8-ab4a-0050569f2651; Value: 100; Part Number: RC0805FR-07120RL; Component Type: SMD; Part Type: Thick Film; Temperature Range: -55°C ~ 155°C; ComponentLink1URL: https://eu.mouser.com/datasheet/2/447/PYu_RC_Group_51_RoHS_L_10-1664068.pdf; Price: 0,0014; ComponentLink1Description: Datasheet
R12 = RC0805FR-071KL: as R13 on sheet CHARGER_2A; Value: 1k; Part Number: RC0805FR-071KL; Component Type: SMD; Part Type: Thick Film; Temperature Range: -55°C ~ 155°C; ComponentLink1URL: https://eu.mouser.com/datasheet/2/447/PYu_RC_Group_51_RoHS_L_10-1664068.pdf; Supplier 1: Digi-Key; Supplier Part Number 1: 311-1.00KCRTR-ND; Price: 0,0014; ComponentLink1Description: Datasheet
VT3 = 2N7002,215: 60V, 300mA max N-Channel Trench MOSFET, 3.8Ohm @ Vgs = 4.5V; Manufacturer: Nexperia USA; Ajax_1C_ID: 8875; Ajax_1C_PN: 2N7002.215 , NXP полевой транзистор; Ajax_1С_Status: Mass Production; Component Status: Released; Standard Lead Time: 4 Weeks; Replacement: NONE; GUID_1C: 4d2e7416-6b97-11e6-8203-d8cb8a9acc66; Part Number: 2N7002,215; Part Type: N-Channel; Component Type: SMD; Temperature Range: -65°C ~ 150°C; ComponentLink1URL: https://assets.nexperia.com/documents/data-sheet/2N7002.pdf; Supplier 1: Digi-Key; Supplier Part Number 1: 1727-2764-2-ND; Price: 0.0202; ComponentLink1Description: Datasheet

## Sheet PD_TRIGGER.SchDoc: =DocumentName
size A4; Author: Starovit; CompanyName: "AS Manufacturing" LLC; Organization: "AS Manufacturing" LLC; Address1: 5 Sklyarenka St.; Address2: Kyiv 04073; Address3: Ukraine; Address4: https://ajax.systems/en/; DocumentNumber: 6; Revision: v4; SheetNumber: 6; SheetTotal: 7; Product name: WiFi_UPS; Internal reference: 001; Head: WiFi_UPS.001.v4; PCB_Designator: WiFi_UPS.001.v4; Template_version: 1.0.1
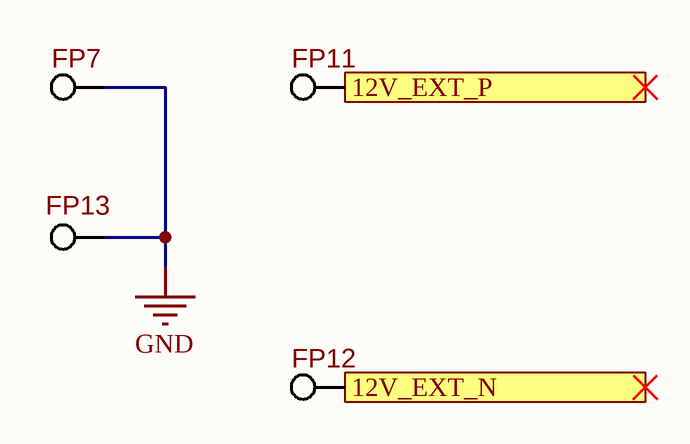
[diagram p5: PD_TRIGGER.SchDoc]

### Parts
FP7  PAD-1.45mm  [PAD-1.45mm]  (value not drawn)  (no BOM)
FP11  PAD-1.45mm  [PAD-1.45mm]  (value not drawn)  (no BOM)
FP12  PAD-1.45mm  [PAD-1.45mm]  (value not drawn)  (no BOM)
FP13  PAD-1.45mm  [PAD-1.45mm]  (value not drawn)  (no BOM)

### Ports
12V_EXT_N, 12V_EXT_P

### Nets
GND: FP7.1 FP12.1 FP13.1 ; port 12V_EXT_N
NetFP11_1: FP11.1 ; port 12V_EXT_P

### Notes on the sheet
- Title
- Product:
- Project:
- Size:
- Date:
- Variant:
- A4
- Authors:
- Time:
- Sheet
- of
- Revision:
- @Vitech_ua
- Commit:

### Library data of the parts
FP7 FP11-FP13 = PAD-1.45mm: as FP10 on sheet CHARGER_2A; Part Number: PAD-1.45mm; Component Type: PTH; Manufacturer: NONE; Part Type: Pad; Temperature Range: NONE; ComponentLink1URL: NONE; Replacement: NONE; Price: NONE; ComponentLink1Description: Datasheet

## Sheet StepDown_LM2596.SchDoc: =DocumentName
size A4; Author: Starovit; CompanyName: "AS Manufacturing" LLC; Organization: "AS Manufacturing" LLC; Address1: 5 Sklyarenka St.; Address2: Kyiv 04073; Address3: Ukraine; Address4: https://ajax.systems/en/; DocumentNumber: 7; Revision: v4; SheetNumber: 7; SheetTotal: 7; Product name: WiFi_UPS; Internal reference: 001; Head: WiFi_UPS.001.v4; PCB_Designator: WiFi_UPS.001.v4; Template_version: 1.0.1
Used 2 times, as channels SD, SD. Parts and nets are listed once, with the designators drawn on the sheet.
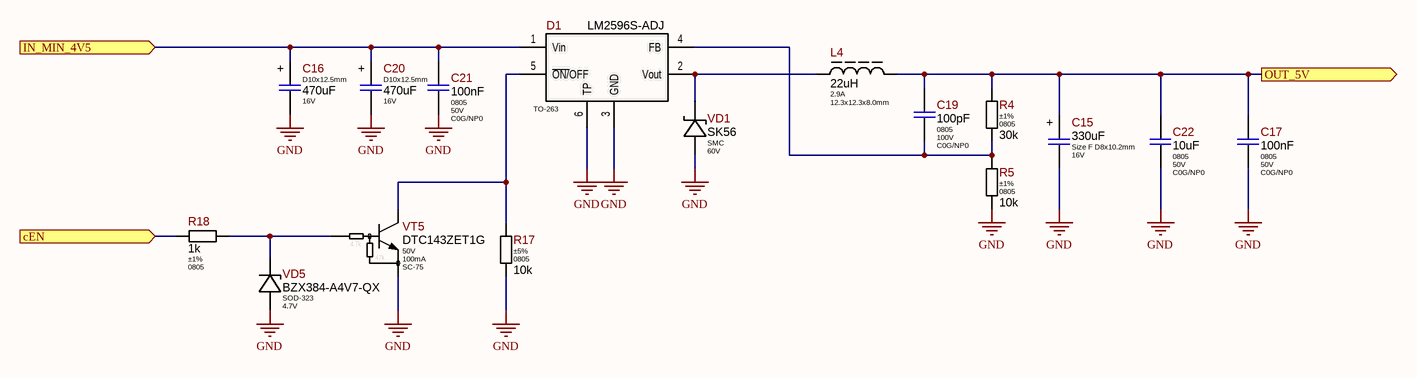
[diagram p6: StepDown_LM2596.SchDoc]

### Parts
C15  value 330uF  Package: Size F D8x10.2mm  Voltage: 16V  [CAP-AE-830x1020H30_MED]  (hidden comment: 330uFx16V)
C16  value 470uF  Package: D10x12.5mm  Voltage: 16V  [CAP-AE-PTH-100D10x125H15]  (hidden comment: 470uFx16V)
C17  Package: 0805  Voltage: 50V  Dielectric Type: C0G/NP0  [C_CERAMIC_0805_HI]  (hidden comment: 100nF)
C19  Package: 0805  Voltage: 100V  Dielectric Type: C0G/NP0  [CAP-0805(2012)X60T10]  (hidden comment: 100pF)
C20  value 470uF  Package: D10x12.5mm  Voltage: 16V  [CAP-AE-PTH-100D10x125H15]  (hidden comment: 470uFx16V)
C21  Package: 0805  Voltage: 50V  Dielectric Type: C0G/NP0  [C_CERAMIC_0805_HI]  (hidden comment: 100nF)
C22  Package: 0805  Voltage: 50V  Dielectric Type: C0G/NP0  [C_CERAMIC_0805_HI]  (hidden comment: 10uF)
D1  Package: TO-263  [TO-263-5-1]  (hidden comment: LM2596S-ADJ)
L4  Current: 2.9A  Package: 12.3x12.3x8.0mm  [CDRH127-Series]  (hidden comment: 22uH)
R4  Tolerance: ±1%  Package: 0805  [R_ANY_CHIP_0805_MED]  (hidden comment: 30k)
R5  Tolerance: ±1%  Package: 0805  [R_ANY_CHIP_0805_MED]  (hidden comment: 10k)
R17  value 10k  Tolerance: ±5%  Package: 0805  [R_ANY_CHIP_0805_MED]  (hidden comment: 68k)
R18  Tolerance: ±1%  Package: 0805  [R_ANY_CHIP_0805_MED]  (hidden comment: 1k)
VD1  Voltage: 60V  [SMC]  (hidden comment: SK56)
VD5  Package: SOD-323  Voltage: 4.7V  [SOD-323_MED]  (hidden comment: BZX384-A4V7-QX)
VT5  Vce: 50V  Ic: 100mA  Package: SC-75  [SOT-416]  (hidden comment: DTC143ZET1G)

### Ports
cEN (in), IN_MIN_4V5 (in), OUT_5V (out)

### Nets
GND: C15.2 C16.2 C17.2 C20.2 C21.2 C22.2 D1.3(GND) D1.6(TP) R5.2 R17.2 VD1.AN VD5.AN VT5.2(E)
cEN: R18.1 ; port cEN
IN_MIN_4V5: C16.1 C20.1 C21.1 D1.1(Vin) ; port IN_MIN_4V5
OUT_5V: C15.1 C17.1 C19.2 C22.1 L4.2 R4.1 ; port OUT_5V
NetC19_1: C19.1 D1.4(FB) R4.2 R5.1
NetD1_2: D1.2(Vout) L4.1 VD1.CA
NetD1_5: D1.5(~{ON/}OFF) R17.1 VT5.3(C)
NetR18_2: R18.2 VD5.CA VT5.1(B)

### Channels
SD: designators end in B; ports cEN=cEN IN_MIN_4V5=12V_EXT OUT_5V=5V_EXT
SD: designators end in A; ports cEN=cEN IN_MIN_4V5=12V_EXT OUT_5V=5V_CHARGER

### Notes on the sheet
- Title
- Product:
- Project:
- Size:
- Date:
- Variant:
- A4
- Authors:
- Time:
- Sheet
- of
- Revision:
- @Vitech_ua
- Commit:
- (in symbol DTC143ZET1G) 4.7k; 47k
- (in symbol EEE-1HA330AP) +
- (in symbol EXR471M16B) +

### Library data of the parts
C15 = EEE-1HA330AP: as C8 on sheet comutator; Part Type: Aluminum; Component Type: SMD; Temperature Range: -40°C ~ 85°C; Tolerance: ±20%; ComponentLink1URL: https://eu.mouser.com/datasheet/2/315/ABA0000C1142-947446.pdf; Supplier 1: Mouser; Supplier Part Number 1: EEEFK1C331P; Replacement: NONE; Price: 0.625; ComponentLink1Description: Datasheet
C16 = EXR471M16B: 470uF 16V D10x12.5mm Electrolytic Low Impedance; Manufacturer: Hitano; Ajax_1C_ID: 15747; Ajax_1C_PN: 470uF 16V 10x12.5mm EXR EXR471M16B-Hitano pcs; Ajax_1С_Status: Mass Production; Standard Lead Time: NONE; Component Status: Released; Tolerance: ±20%; GUID_1C: 3364ee07-6280-11e9-ab4f-0050569f2651; Part Number: EXR471M16B; Part Type: Aluminum; Component Type: PTH; Temperature Range: -40°C ~ 105°C; Dielectric Type: NONE; ComponentLink1URL: https://www.hitano.com.tw/wp-content/uploads/doc/EXR_20200408.pdf; Replacement: NONE; Price: 0,045; ComponentLink1Description: Datasheet
C17 C21 C22 = CERAMIC_0805: as C2 on sheet STEP-UP; Part Type: Ceramic / C0G(NP0) / 0402; Component Type: SMD; Temperature Range: -55°C ~ 125°C; ComponentLink1URL: \\altiumdb.ajax.local\files\Datasheet\Capacitor\Hitano-MLCC.pdf; Price: 0; ComponentLink1Description: Datasheet
  C17 C21: Value: 100nF
  C22: Value: 10uF
C19 = CC0805JRNPO0BN101: 100pF 100V C0G, NP0 ±5% 0805 Ceramic Capacitor RoHS; Manufacturer: Yageo; Ajax_1C_PN: NONE; Ajax_1С_Status: RND Only; Standard Lead Time: 14 Weeks; Component Status: Released; Value: 100pF; Part Number: CC0805JRNPO0BN101; Part Type: Ceramic / C0G(NP0) / 0805; Component Type: SMD; Temperature Range: -55°C ~ 125°C; Tolerance: ±5%; ComponentLink1URL: https://eu.mouser.com/datasheet/2/447/UPY_NP0X7R_MV_100_to_630V_24-2604388.pdf; Supplier 1: Mouser; Supplier Part Number 1: 603-CC805JRNPO0BN101; Replacement: NONE; Price: NONE; ComponentLink1Description: Datasheet
C20 = EXR471M16B: 470uF 16V D10x12.5mm Electrolytic Low Impedance; Part Number: ECAP 470/16V 0812 105'C EHR; Manufacturer: Hitano; Ajax_1C_ID: 15747; Ajax_1C_PN: 470uF 16V 10x12.5mm EXR EXR471M16B-Hitano pcs; Ajax_1С_Status: Mass Production; Standard Lead Time: NONE; Component Status: Released; Tolerance: ±20%; GUID_1C: 3364ee07-6280-11e9-ab4f-0050569f2651; Part Type: Aluminum; Component Type: PTH; Temperature Range: -40°C ~ 105°C; Dielectric Type: NONE; ComponentLink1URL: https://www.hitano.com.tw/wp-content/uploads/doc/EXR_20200408.pdf; Replacement: NONE; Price: 0,045; ComponentLink1Description: Datasheet
D1 = LM2596S-ADJ: SIMPLE SWITCHER Power Converter 150-kHz 3-A Step-Down Voltage Regulator; Manufacturer: Texas Instruments; Ajax_1C_ID: 5535; Ajax_1C_PN: LM2596S-ADJ 150 kHz 3A Step-Down Voltage Regulator; Ajax_1С_Status: Mass Production; Standard Lead Time: 6 Weeks; Component Status: Released; Replacement: NONE; GUID_1C: db77318d-6bf0-11e4-9c1d-a45d36c4a9e5; Part Number: LM2596S-ADJ; Part Type: Power / DC-DC / Buck; Component Type: SMD; Temperature Range: -40°C ~ 125°C; ComponentLink1URL: http://www.ti.com/lit/ds/symlink/lm2596.pdf; Supplier 1: Mouser; Supplier Part Number 1: 926-LM2596S-ADJ/NOPB; Price: 0,44526902; ComponentLink1Description: Datasheet
L4 = CDRH127NP-102MC: 22 µH Shielded Inductor 2.9 A 66mOhm Max Nonstandard; Part Number: CDRH124NP-220MC; Manufacturer: Sumida; Saturation Current: 3.8A; Tolerance: ±20%; Component Status: Released; Standard Lead Time: 17 Weeks; Replacement: NONE; Value: 22uH; Part Type: Power / Ferrite Core; Component Type: SMD; Temperature Range: -40°C ~ 100°C; ComponentLink1URL: https://imrad.com.ua/ru/cdrh124np-220mc; Supplier 1: Mouser; Supplier Part Number 1: 851-CDRH127NP-102MC; Price: 1.55; ComponentLink1Description: Datasheet
R4 = RC0805FR-0730KL: 30 kOhms ±1%, 1/8W 0805 Thick Film Resistor; Manufacturer: Yageo; Ajax_1C_ID: 9642; Ajax_1C_PN: 30k 1% 0805 Resistors SMD RoHS; Ajax_1С_Status: Mass Production; Power Rating: 0.125W; Voltage: 150V; Component Status: Released; Temperature Stability: ±100ppm/°C; Replacement: NONE; GUID_1C: 71e2aa09-07e0-11e7-82d0-d8cb8a9acc66; Value: 30k; Part Number: RC0805FR-0730KL; Component Type: SMD; Part Type: Thick Film; Temperature Range: -55°C ~ 155°C; ComponentLink1URL: https://eu.mouser.com/datasheet/2/447/PYu_RC_Group_51_RoHS_L_10-1664068.pdf; Supplier 1: Digi-Key; Supplier Part Number 1: 311-30.0KCRTR-ND; Price: 0,001; ComponentLink1Description: Datasheet
R5 = RC0805FR-0710K2L: 10 kOhms ±1%, 1/8W 0805 Thick Film Resistor; Manufacturer: Yageo; Ajax_1C_ID: 13943; Ajax_1C_PN: 10.2k 1% 0805 Resistors SMD RoHS; Ajax_1С_Status: Mass Production; Power Rating: 0.125W; Voltage: 150V; Component Status: Released; Temperature Stability: ±100ppm/°C; Replacement: NONE; GUID_1C: 8bc9d0ce-c58a-11e8-ab47-0050569f2651; Value: 10k; Part Number: RC0805FR-0710K2L; Component Type: SMD; Part Type: Thick Film; Temperature Range: -55°C ~ 155°C; ComponentLink1URL: https://eu.mouser.com/datasheet/2/447/PYu_RC_Group_51_RoHS_L_10-1664068.pdf; Supplier 1: Digi-Key; Supplier Part Number 1: 311-10.2KCRTR-ND; Price: 0,0014; ComponentLink1Description: Datasheet
R17 = RC0805JR-072K2L: as R1 on sheet STEP-UP; Part Number: RC0805JR-072K2L; Component Type: SMD; Part Type: Thick Film; Temperature Range: -55°C ~ 155°C; ComponentLink1URL: https://eu.mouser.com/datasheet/2/447/PYu_RC_Group_51_RoHS_L_11-1984063.pdf; Supplier 1: Digi-Key; Supplier Part Number 1: 311-2.2KARTR-ND; Price: 0,005; ComponentLink1Description: Datasheet
R18 = RC0805FR-072K2L: as R19 on sheet STEP-UP; Value: 1k; Part Number: RC0805FR-072K2L; Component Type: SMD; Part Type: Thick Film; Temperature Range: -55°C ~ 155°C; ComponentLink1URL: https://eu.mouser.com/datasheet/2/447/YAGEO_PYu_RC_Group_51_RoHS_L_12-3313492.pdf; Supplier 1: Mouser; Supplier Part Number 1: 603-RC0805FR-072K2L; Price: 0.0014; ComponentLink1Description: Datasheet
VD1 = SS34: as VD2 on sheet MAIN; Part Number: SK56; Package: SMC; Part Type: Schottky; Component Type: SMD; Marking: SK56; Temperature Range: -55°C ~ 150°C; Supplier 1: Digi-Key; Supplier Part Number 1: SS34FSCT-ND; Price: 0.03; ComponentLink1Description: Datasheet
VD5 = BZX384-A4V7-QX: as VD6 on sheet STEP-UP; Part Number: BZX384-A4V7-QX; Part Type: Zener; Component Type: SMD; Temperature Range: -65°C ~ 150°C; ComponentLink1URL: https://eu.mouser.com/datasheet/2/916/BZX384_Q_SER-2721638.pdf; Supplier 1: Mouser; Supplier Part Number 1: 771-BZX384-A4V7-QX; Replacement: NONE; Price: NONE; ComponentLink1Description: Datasheet
VT5 = DTC143ZET1G: as VT4 on sheet comutator; Part Number: DTC143ZET1G; Part Type: NPN; Component Type: SMD; Temperature Range: -55°C ~ 150 °C; ComponentLink1URL: http://www.onsemi.com/pub/Collateral/DTC143Z-D.PDF; Supplier 1: Digi-Key; Supplier Part Number 1: DTC143ZET1GOSTR-ND; Price: 0.015; ComponentLink1Description: Datasheet

## Nets that join several sheets
5V_EXT: STEP_UP (C1B.1 C2B.1 D2B.5 L1B.1), comutator (6 pins), SD (6 pins), STEP_UP (C1A.1 C2A.1 D2A.5 L1A.1)
12V_EXT: MAIN (TP1.1 VD2.CA X5.1), SD (C16B.1 C20B.1 C21B.1 D1B.1), SD (C16A.1 C20A.1 C21A.1 D1A.1)
GND: MAIN (X1.1 X2.2 X3.2), STEP_UP (9 pins), CHARGER_2A (12 pins), comutator (5 pins), BAT_&_PROTECTOR (10 pins), PD_TRIGGER (FP7.1 FP12.1 FP13.1), SD (13 pins), STEP_UP (9 pins), SD (13 pins)
5V_CHARGER: MAIN (TP2.1), CHARGER_2A (5 pins), SD (6 pins)
cEN: MAIN (TP3.1 X5.2), STEP_UP (R19B.1), SD (R18B.1), STEP_UP (R19A.1), SD (R18A.1)
MODEM_PWR: MAIN (X2.1), STEP_UP (5 pins)
NetC14_1: CHARGER_2A (5 pins), comutator (6 pins), BAT_&_PROTECTOR (FU1.2 R11.2)
NetFP11_1: MAIN (VD2.AN X4.2), comutator (R15.1 TP8.1), PD_TRIGGER (FP11.1)
ROUTER_PWR: MAIN (X3.1), STEP_UP (5 pins)